# EAGLE design dual power supply (EAGLE 9.6.2)
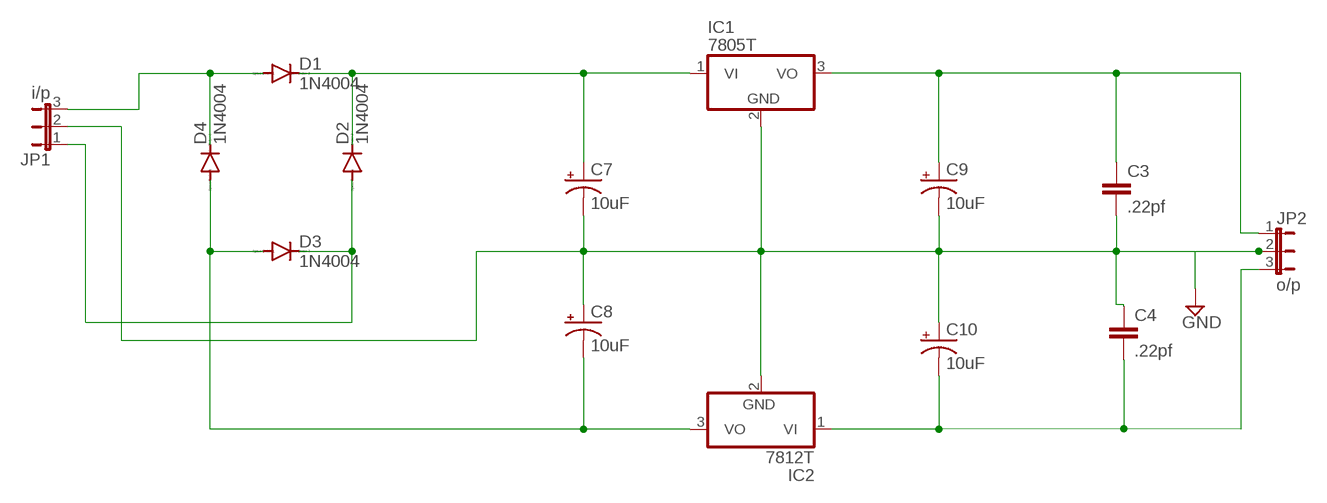
[diagram p0: schematic, sheet 1]

## Parts
C3  .22pf  C2,5-3  [C2.5-3]
C4  .22pf  C2,5-3  [C2.5-3]
C7  10uF  CPOL-USE3.5-8  [E3,5-8]
C8  10uF  CPOL-USE3.5-8  [E3,5-8]
C9  10uF  CPOL-USE3.5-8  [E3,5-8]
C10  10uF  CPOL-USE3.5-8  [E3,5-8]
D1  1N4004  [DO41-10]
D2  1N4004  [DO41-10]
D3  1N4004  [DO41-10]
D4  1N4004  [DO41-10]
IC1  7805T  [TO220H]
IC2  7812T  [TO220H]
JP1  i/p  JP2E  [JP2]
JP2  o/p  JP2E  [JP2]

## Nets
GND: C3.2 C4.1 C7.- C8.+ C9.- C10.+ IC1.2(GND) IC2.2(GND) JP1.2 JP2.2
N$2: D1.A D4.C JP1.3
N$3: C7.+ D1.C D2.C IC1.1(VI)
N$4: C4.2 C10.- IC2.1(VI) JP2.3
N$5: C3.1 C9.+ IC1.3(VO) JP2.1
N$6: D2.A D3.C JP1.1
N$7: C8.- D3.A D4.A IC2.3(VO)

## Library data of the parts
C3 C4 = capacitor-wima:C: CAPACITOR naming: grid - package width
C7-C10 = rcl:CPOL-US: POLARIZED CAPACITOR, American symbol; SPICEPREFIX: C
D1-D4 = diode:1N4004: DIODE general purpose rectifier, 1 A
IC1 IC2 = linear:78*: Positive VOLTAGE REGULATOR Source: http://cache.national.com/ds/LM/LM78L05.pdf http://www.fairchildsemi.com/ds/LM/LM7805.pdf
JP1 JP2 = jumper:JP2E: JUMPER

## Board
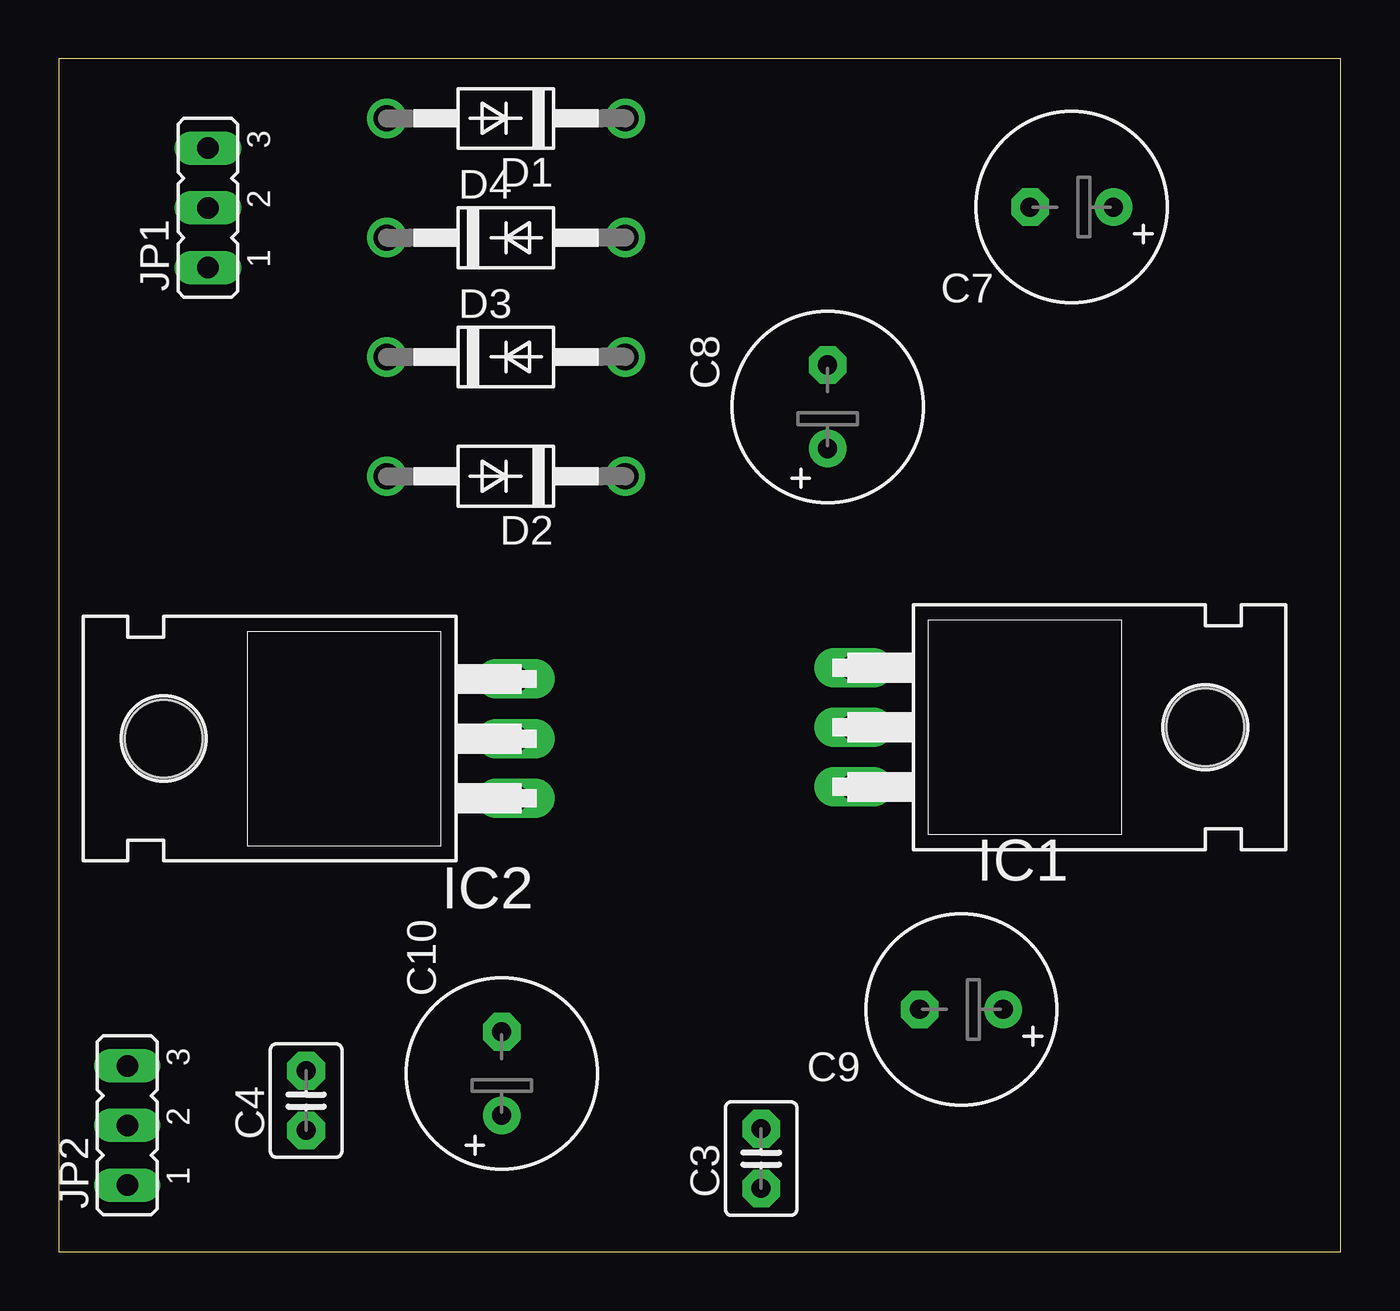
[diagram p1: board, top side]
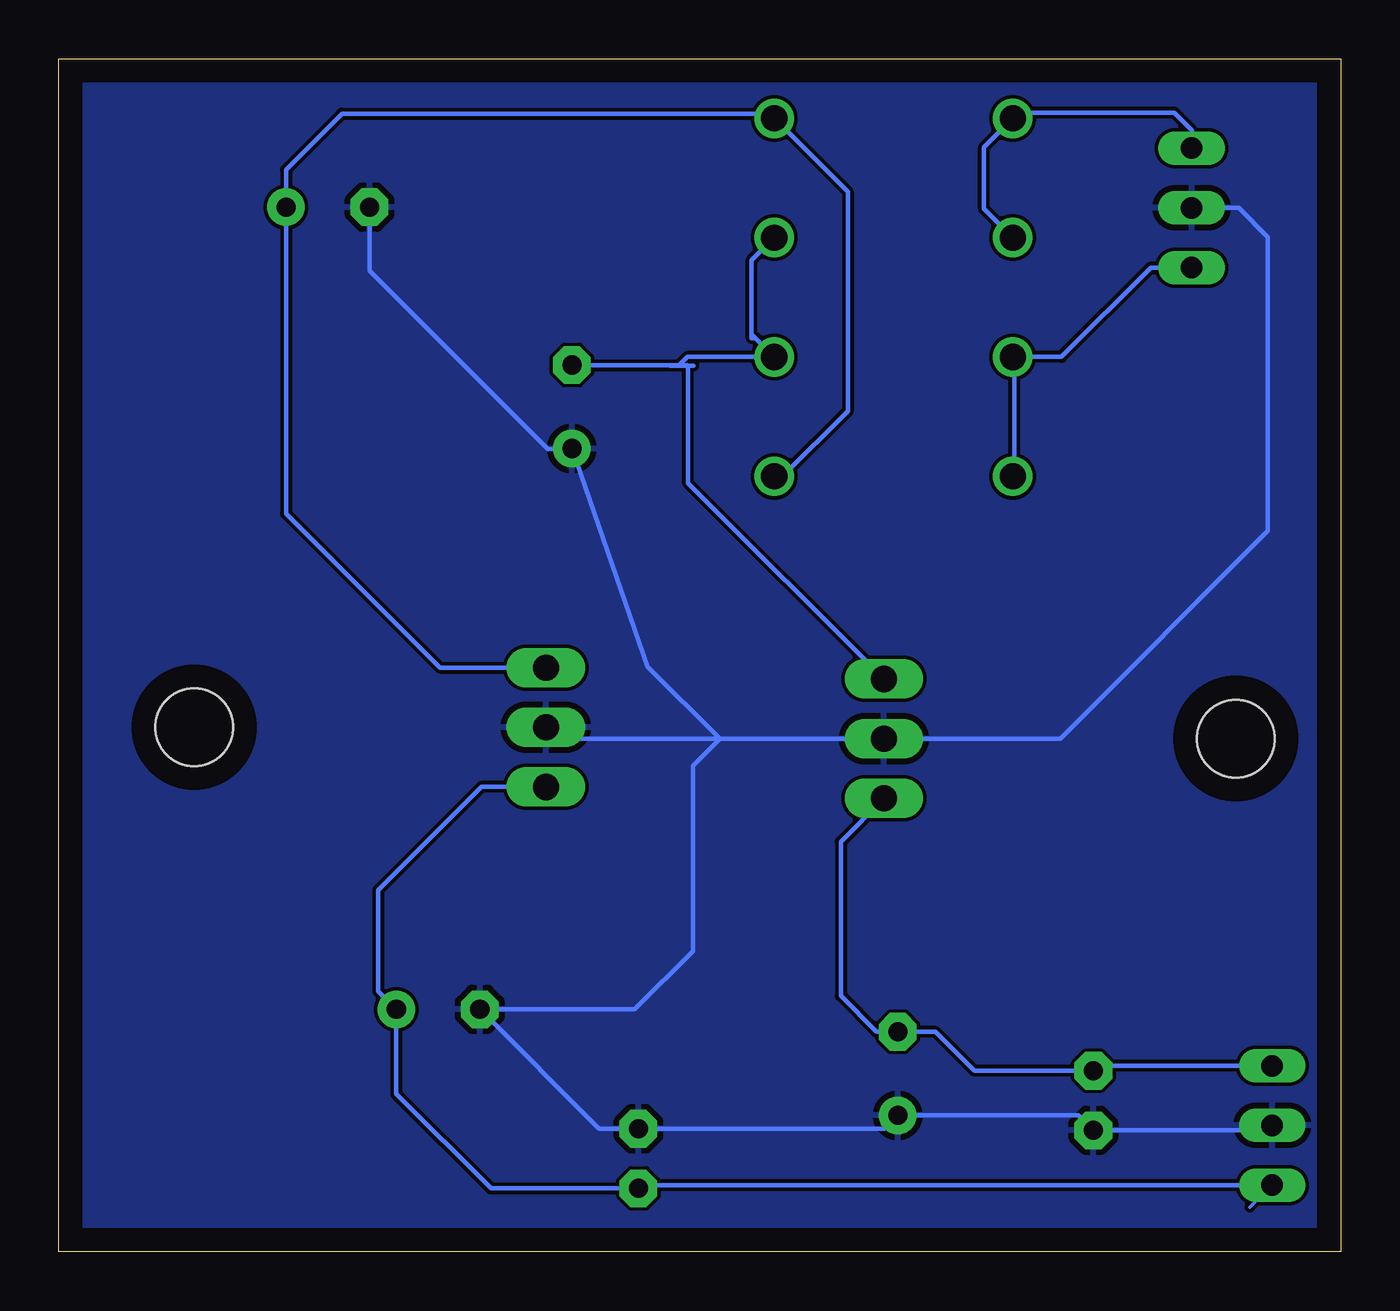
[diagram p2: board, bottom side, seen from below]

Size 54.61 x 50.8 mm. Coordinates in mm from the lower left corner, seen from the top.
Outline: 0,0 54.61,0 54.61,50.8 0,50.8 0,0
Copper layers (1*16): Top 0.035mm / dielectric 1.5mm / Bottom 0.035mm
Design rules "default": minimum track width 6mil, minimum drill 0.35mm, track to track 6mil, track to pad 6mil, pad to pad 6mil, via to via 6mil, smd to smd 6mil, copper to edge 40mil, drill to drill 6mil, minimum pad ring 10mil, minimum via ring 8mil, stop-mask expansion 4mil, vias tented up to drill 0mil, thermal gap 10mil

### Footprints (pad centres in the part's own frame; a part is rotated, then mirrored left to right if it is on the bottom)
C2.5-3 = drill 0.813 pad 1.6 octagon: 1 -1.27,0; 2 1.27,0
E3,5-8 = drill 0.813 pad 1.6: + -1.778,0 | drill 0.813 pad 1.6 octagon: - 1.778,0
DO41-10 = drill 1.118: A 5.08,0; C -5.08,0
TO220H = drill 1.118 long: 1 -2.54,-10.16; 2 0,-10.16; 3 2.54,-10.16 | hole 3.302: 0,4.826
JP2 = drill 0.914 long: 1 -2.54,0; 2 0,0; 3 2.54,0

### Placement (x,y rotation side)
C3  29.92,3.97 90 top
C4  10.54,6.44 90 top
C7  43.15,44.48 180 top
C8  32.75,35.98 90 top
C9  38.45,10.32 180 top
C10  18.87,7.59 90 top
D1  19.05,48.26 180 top
D2  19.05,33.02 180 top
D3  19.05,38.1 0 top
D4  19.05,43.18 0 top
IC1  44.02,22.33 270 top
IC2  9.3,21.85 90 top
JP1  6.35,44.45 90 top
JP2  2.92,5.38 90 top

### Tracks (layer width: path | path; a pad name or v marks a point on that pad's centre or on a via)
GND
  Bottom 0.152: C3.2 29.5,5.24 28.92,5.24 | C4.1 10.73,5.37
  Bottom 0.2: C7.- 41.37,41.77 33.77,34.17 C8.+ 29.52,24.92 26.45,21.85 | JP1.2 4.35,44.45 3.1,43.2 3.1,30.7 11.95,21.85 IC2.2 26.45,21.85 | IC1.2 33.37,21.85 26.45,21.85 | 26.45,21.85 27.6,20.7 27.6,12.8 30.08,10.32 C9.- 31.59,5.24 29.5,5.24 | C3.2 19.44,5.24 C10.+ 11.18,5.81 10.73,5.37 | C4.1 3.13,5.17 JP2.2
  pour Bottom: 0,50.8 54.55,50.8 54.8,50.55 54.8,47.6 54.8,0.05 54.55,-0.2 54.5,-0.2 0,-0.2
N$2
  Bottom 0.2: JP1.3 6.35,47.75 7.1,48.5 13.73,48.5 D1.A 15.2,47.03 15.2,44.41 D4.C
N$3
  Bottom 0.2: D2.C 23.78,33.02 21,35.8 21,45.13 D1.C 24.63,48.26 24.83,48.46 42.54,48.46 44.93,46.07 C7.+ 44.93,31.43 38.37,24.87 IC1.1
N$4
  Bottom 0.152: 18.46,9.78 C10.-
  Bottom 0.2: IC2.1 21.3,17.47 21.3,10.9 19.77,9.37 C10.- | JP2.3 10.33,7.92 C4.2 15.61,7.71 17.27,9.37 C10.-
N$5
  Bottom 0.152: 29.99,2.77 C3.1 | 3.87,1.89 JP2.1
  Bottom 0.2: IC1.3 36.61,19.79 41,15.4 41,11.09 C9.+ 40.23,6.73 36.2,2.7 30.3,2.7 | 30.3,2.7 C3.1 | JP2.1 30.16,2.84 30.3,2.7
N$6
  Bottom 0.2: JP1.1 8.09,41.91 11.9,38.1 13.9,38.1 | 13.9,38.1 D3.C | D2.A 13.9,33.09 13.9,38.1
N$7
  Bottom 0.2: D4.A 25.1,42.21 25.1,38.9 24.93,38.9 | 24.93,38.9 D3.A 27.83,38.1 28.2,37.73 | 27.8,37.73 27.57,37.73 | 25.03,39 24.93,38.9 | IC2.3 27.8,32.73 27.8,37.73 | 27.8,37.73 28.2,37.73 | 28.2,37.73 28.57,37.73 | C8.- 27.83,37.76 27.8,37.73